# EAGLE design labortagebadge2013 (EAGLE 6.5.0)
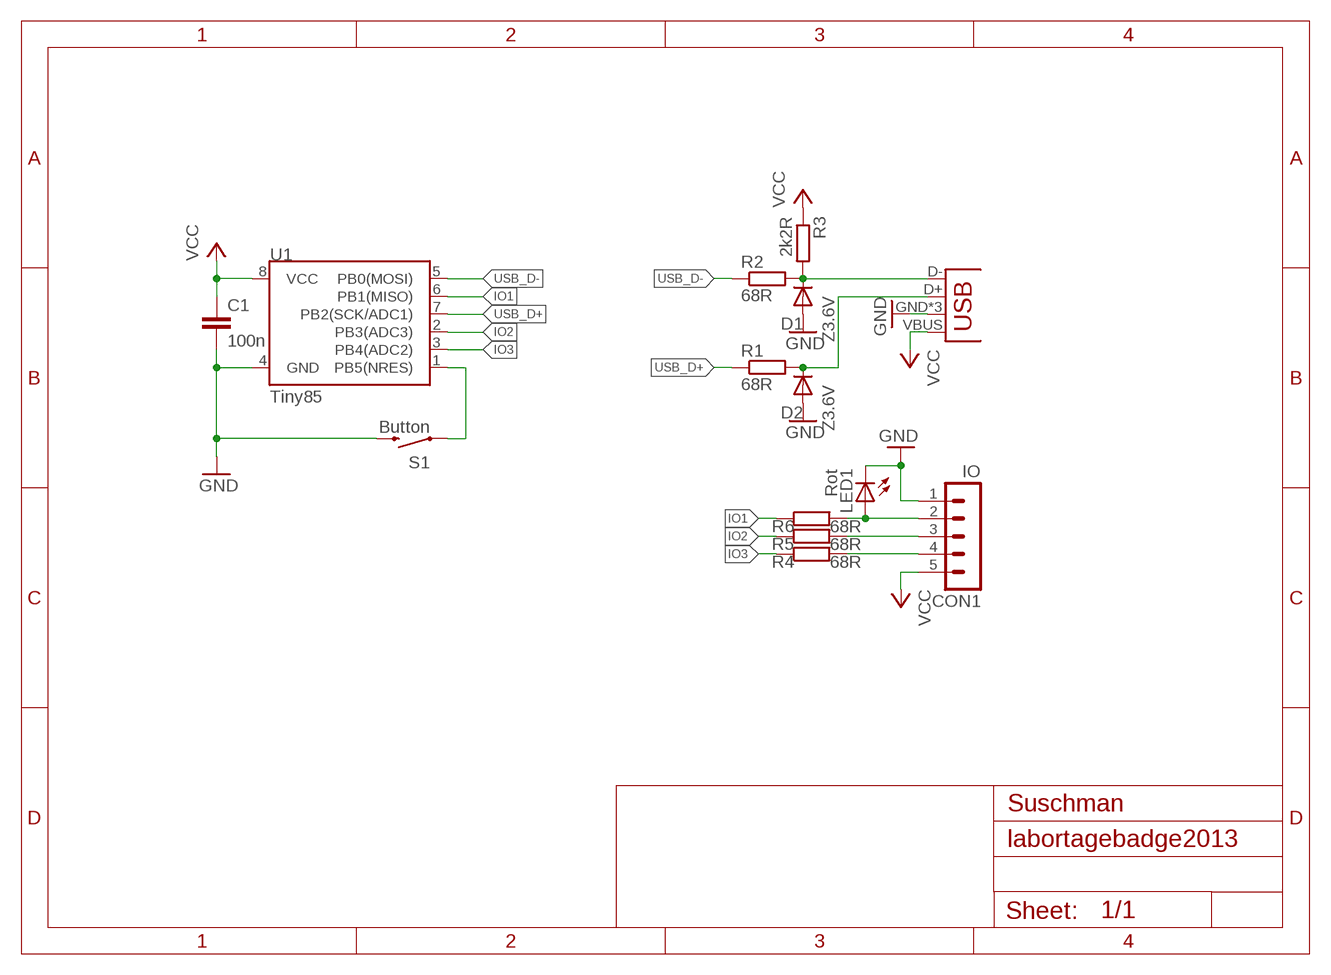
[diagram p0: schematic, sheet 1]

## Parts
C1  100n  C-EUC0805  [C0805]
CON1  IO  MA05-1  [MA05-1]
D1  Z3.6V  DIODE-MINIMELF  [MINIMELF]
D2  Z3.6V  DIODE-MINIMELF  [MINIMELF]
LED1  Rot  LEDCHIPLED_0805  [CHIPLED_0805]
R1  68R  R-EU_R0805  [R0805]
R2  68R  R-EU_R0805  [R0805]
R3  2k2R  R-EU_R0805  [R0805]
R4  68R  R-EU_R0805  [R0805]
R5  68R  R-EU_R0805  [R0805]
R6  68R  R-EU_R0805  [R0805]
S1  Button  SWITCH-MOMENTARY-2  [TACTILE_SWITCH_TALL]
U1  Tiny85  ATTINY45TINY85-20-SMT  [SO08-EIAJ]
USB-A  USB-A  USB-A-H  [USB-A-H]

## Nets
GND: C1.2 CON1.1 D1.A D2.A LED1.C S1.B1 S1.B2 U1.4(GND) USB-A.GND2(VBUS) USB-A.GND3(VBUS) USB-A.GND(VBUS)
IO1: R6.1 U1.6(PB1(MISO))
IO2: R5.1 U1.2(PB3(ADC3))
IO3: R4.1 U1.3(PB4(ADC2))
N$1: D2.C R1.2 USB-A.D+(D-)
N$3: S1.A1 S1.A2 U1.1(PB5(NRES))
N$4: CON1.4 R4.2
N$5: CON1.3 R5.2
N$6: CON1.2 LED1.A R6.2
N$7: D1.C R2.2 R3.2 USB-A.D-(D+)
USB_D+: R1.1 U1.7(PB2(SCK/ADC1))
USB_D-: R2.1 U1.5(PB0(MOSI))
VCC: C1.1 CON1.5 R3.1 U1.8(VCC) USB-A.VBUS(GND)

## Notes on the sheet
- Suschman

## Library data of the parts
C1 = rcl:C-EU: CAPACITOR, European symbol
CON1 = con-lstb:MA05-1: PIN HEADER; OC_FARNELL: unknown; OC_NEWARK: unknown
D1 D2 = diode:DIODE-: DIODE
LED1 = led:LED: LED OSRAM: - CHIPLED LG R971, LG N971, LY N971, LG Q971, LY Q971, LO R971, LY R971 LH N974, LH R974 LS Q976, LO Q976, LY Q976 LO Q996 - Hyper CHIPLED LW Q18S LB Q993, LB Q99A, LB R99A - SideLED LS A670, LO A670, LY A670, LG A670, LP A670 LB A673, LV A673, LT A673, LW A673 LH A674 LY A675 LS A676, LA A676, LO A676, LY A676, LW A676 LS A679, LY A679, LG A679 - Hyper Micro SIDELEDÂ® LS Y876, LA Y876, LO Y876, LY Y876 LT Y87S - SmartLED LW L88C, LW L88S LB L89C, LB L89S, LG L890 LS L89K, LO L89K, LY L89K LS L896, LA L896, LO L896, LY L896 - TOPLED LS T670, LO T670, LY T670, LG T670, LP T670 LSG T670, LSP T670, LSY T670, LOP T670, LYG T670 LG T671, LOG T671, LSG T671 LB T673, LV T673, LT T673, LW T673 LH T674 LS T676, LA T676, LO T676, LY T676, LB T676, LH T676, LSB T676, LW T676 LB T67C, LV T67C, LT T67C, LS T67K, LO T67K, LY T67K, LW E67C LS E67B, LA E67B, LO E67B, LY E67B, LB E67C, LV E67C, LT E67C LW T67C LS T679, LY T679, LG T679 LS T770, LO T770, LY T770, LG T770, LP T770 LB T773, LV T773, LT T773, LW T773 LH T774 LS E675, LA E675, LY E675, LS T675 LS T776, LA T776, LO T776, LY T776, LB T776 LHGB T686 LT T68C, LB T68C - Hyper Mini TOPLEDÂ® LB M676 - Mini TOPLED SantanaÂ® LG M470 LS M47K, LO M47K, LY M47K Source: http://www.osram.convergy.de LUXEON: - LUMILEDÂ® LXK2-PW12-R00, LXK2-PW12-S00, LXK2-PW14-U00, LXK2-PW14-V00 LXK2-PM12-R00, LXK2-PM12-S00, LXK2-PM14-U00 LXK2-PE12-Q00, LXK2-PE12-R00, LXK2-PE12-S00, LXK2-PE14-T00, LXK2-PE14-U00 LXK2-PB12-K00, LXK2-PB12-L00, LXK2-PB12-M00, LXK2-PB14-N00, LXK2-PB14-P00, LXK2-PB14-Q00 LXK2-PR12-L00, LXK2-PR12-M00, LXK2-PR14-Q00, LXK2-PR14-R00 LXK2-PD12-Q00, LXK2-PD12-R00, LXK2-PD12-S00 LXK2-PH12-R00, LXK2-PH12-S00 LXK2-PL12-P00, LXK2-PL12-Q00, LXK2-PL12-R00 Source: www.luxeon.com KINGBRIGHT: KA-3528ASYC Source: www.kingbright.com
R1-R6 = rcl:R-EU_: RESISTOR, European symbol
S1 = SparkFun-Electromechanical:SWITCH-MOMENTARY-2: Various NO switches- pushbuttons, reed, etc
U1 = SparkFun-DigitalIC:ATTINY45: Atmel 8-pin 2/4/8kB flash uC; PROD_ID: IC-09092; VALUE: Tiny85-20-SMT
USB-A = SparkFun-Connectors:USB: USB Connectors USB-B-PTH is fully proven SKU : PRT-00139/CONN-08278 USB-miniB is fully proven SKU : PRT-00587 USB-A-PCB is untested. USB-A-H is throughly reviewed, but untested. Spark Fun Electronics SKU : PRT-00437 USB-B-SMT is throughly reviewed, but untested. Needs silkscreen touching up. USB-A-S has not been used/tested USB-MB-H has not been used/tested USB-MICROB has been used. CONN-09505

## Board
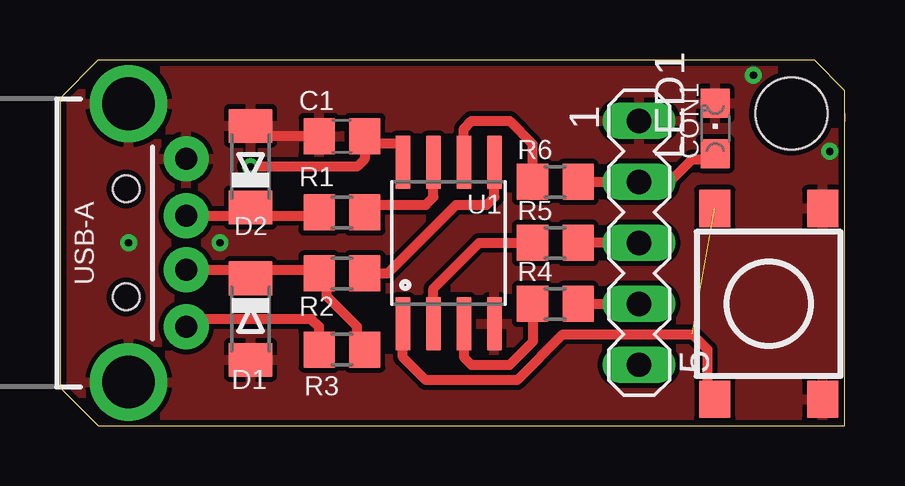
[diagram p1: board, top side]
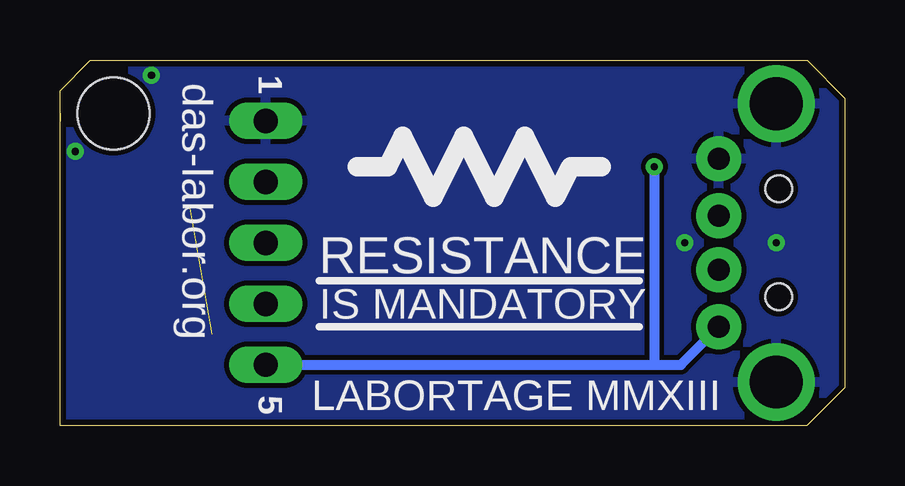
[diagram p2: board, bottom side, seen from below]

Size 32.7 x 15.24 mm. Coordinates in mm from the lower left corner, seen from the top.
Outline: 1.59,0 32.69,0 32.7,13.02 32.69,12.69 32.69,13.96 31.44,15.23 31.11,15.24 1.58,15.23 0,13.65 0,1.59 1.59,0
Copper layers (1*16): Top 0.035mm / dielectric 1.5mm / Bottom 0.035mm
Design rules "default *": minimum track width 10mil, minimum drill 0.3mm, track to track 8mil, track to pad 8mil, pad to pad 8mil, via to via 8mil, smd to smd 8mil, copper to edge 10mil, drill to drill 8mil, minimum pad ring 10mil, minimum via ring 8mil, stop-mask expansion 4mil, vias tented up to drill 0.5mm, thermal gap 8mil
Holes 3 mm at 30.48,13.02

### Footprints (pad centres in the part's own frame; a part is rotated, then mirrored left to right if it is on the bottom)
C0805 = smd 1.3 x 1.5: 1 -0.95,0; 2 0.95,0
MA05-1 = drill 1.016 long: 1 -5.08,0; 2 -2.54,0; 3 0,0; 4 2.54,0; 5 5.08,0
MINIMELF = smd 1.4 x 1.8: A 1.7,0; C -1.7,0
CHIPLED_0805 = smd 1.2 x 1.2: A 0,-1.05; C 0,1.05
R0805 = smd 1.3 x 1.5: 1 -0.95,0; 2 0.95,0
TACTILE_SWITCH_TALL = smd 1.55 x 1.3: A1 -3.975,-2.25; A2 3.975,-2.25; B1 -3.975,2.25; B2 3.975,2.25
SO08-EIAJ = smd 0.61 x 2.21: 1 -1.905,-3.378; 2 -0.635,-3.378; 3 0.635,-3.378; 4 1.905,-3.378; 5 1.905,3.353; 6 0.635,3.353; 7 -0.635,3.353; 8 -1.905,3.353
USB-A-H = drill 0.914 pad 1.88: D+ 2.4,1.127; D- 2.4,-1.127; GND 2.4,3.5; VBUS 2.4,-3.5 | drill 2.2: GND2 0,-5.8; GND3 0,5.8 | hole 1.1: -0.1,2.25; -0.1,-2.25

### Placement (x,y rotation side)
C1  11.75,12.06 180 top
CON1  24.13,7.62 270 top
D1  7.94,4.45 270 top
D2  7.94,10.79 90 top
LED1  27.3,12.38 0 top
R1  11.75,8.89 180 top
R2  11.75,6.35 180 top
R3  11.75,3.17 0 top
R4  20.64,5.08 0 top
R5  20.64,7.62 0 top
R6  20.64,10.16 0 top
S1  29.53,5.08 270 top
U1  16.19,7.62 0 top
USB-A  2.86,7.62 0 top

### Tracks (layer width: path | path; a pad name or v marks a point on that pad's centre or on a via)
GND  (via drill 0.3)
  Top 0.406: C1.2 8.37,12.06
  other vias: 6.67,7.62 2.86,7.62 28.89,14.61 32.07,11.43
  pour Bottom: 0,15.24 32.7,15.24 32.7,0 0,0
  pour Top: 0,15.24 32.7,15.24 32.7,0 0,0
  pour Top (no thermals): 0.32,11.75 1.9,11.75 1.9,3.49 0.32,3.49
  pour Bottom (no thermals): 1.9,11.75 0.32,11.75 0.32,3.49 1.9,3.49
IO1
  Top 0.406: 20,10.16 R6.1 19.68,11.75 18.73,12.7 17.15,12.7 16.83,12.38 U1.6
IO2
  Top 0.406: U1.2 15.56,5.71 17.46,7.62 R5.1
IO3
  Top 0.406: R4.1 19.69,3.5 18.73,2.54 17.15,2.54 16.83,2.86 U1.3
N$1
  Top 0.254: 7.94,8.89 7.94,8.75
  Top 0.406: USB-A.D+ 7.94,8.75 10.65,8.75 R1.2 | 7.94,8.89 D2.C
N$3  (1 unrouted)
  Top 0.406: U1.1 14.29,2.86 15.24,1.91 19.05,1.91 20.95,3.81 26.35,3.81 26.99,3.17 26.99,1.59 26.96,1.3 S1.A2
N$4
  Top 0.406: R4.2 CON1.4
N$5
  Top 0.406: CON1.3 R5.2
N$6
  Top 0.406: R6.2 CON1.2 25.4,10.16 26.35,11.11 27.08,11.11 LED1.A
N$7
  Top 0.406: R3.2 12.38,3.17 12.38,4.13 11.11,5.4 11.11,6.04 R2.2 10.65,6.49 USB-A.D- 7.59,6.49 D1.C
USB_D+
  Top 0.406: R1.1 12.7,9.21 15.24,9.21 15.56,9.53 U1.7
USB_D-
  Top 0.406: R2.1 13.65,6.35 16.51,9.21 17.78,9.21 18.1,9.53 U1.5
VCC  (via drill 0.3)
  Top 0.406: R3.1 10.79,4.13 10.48,4.45 5.58,4.45 USB-A.VBUS | U1.8 14.29,11.75 13.01,11.75 C1.1 12.7,11.11 12.38,10.79 v7.94,10.79
  Bottom 0.406: 7.94,2.54 6.84,2.54 USB-A.VBUS | v7.94,10.79 7.94,2.54 | CON1.5 7.94,2.54

### Text on the board
bPlace: 1 | das-labor.org | RESISTANCE | IS MANDATORY | LABORTAGE MMXIII | 5
bStop: Das Labor
tRestrict: Das Labor
bRestrict: Das Labor